# EAGLE schematic AD Test (EAGLE 7.5.0)
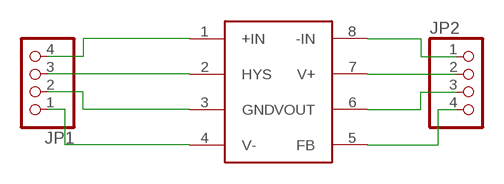
[diagram p0: schematic, sheet 1]

## Parts
JP1  PINHD-1X4  [1X04]
JP2  PINHD-1X4  [1X04]
U$1  AD597ARZ  [SO8]

## Nets
N$1: JP1.4 U$1.1(+IN)
N$2: JP1.3 U$1.2(HYS)
N$3: JP1.2 U$1.3(GND)
N$4: JP1.1 U$1.4(V-)
N$5: JP2.1 U$1.8(-IN)
N$6: JP2.2 U$1.7(V+)
N$7: JP2.3 U$1.6(VOUT)
N$8: JP2.4 U$1.5(FB)

## Library data of the parts
JP1 JP2 = pinhead:PINHD-1X4: PIN HEADER
U$1 = Namenlos:AD597